# EAGLE design Connect (EAGLE 5.11)
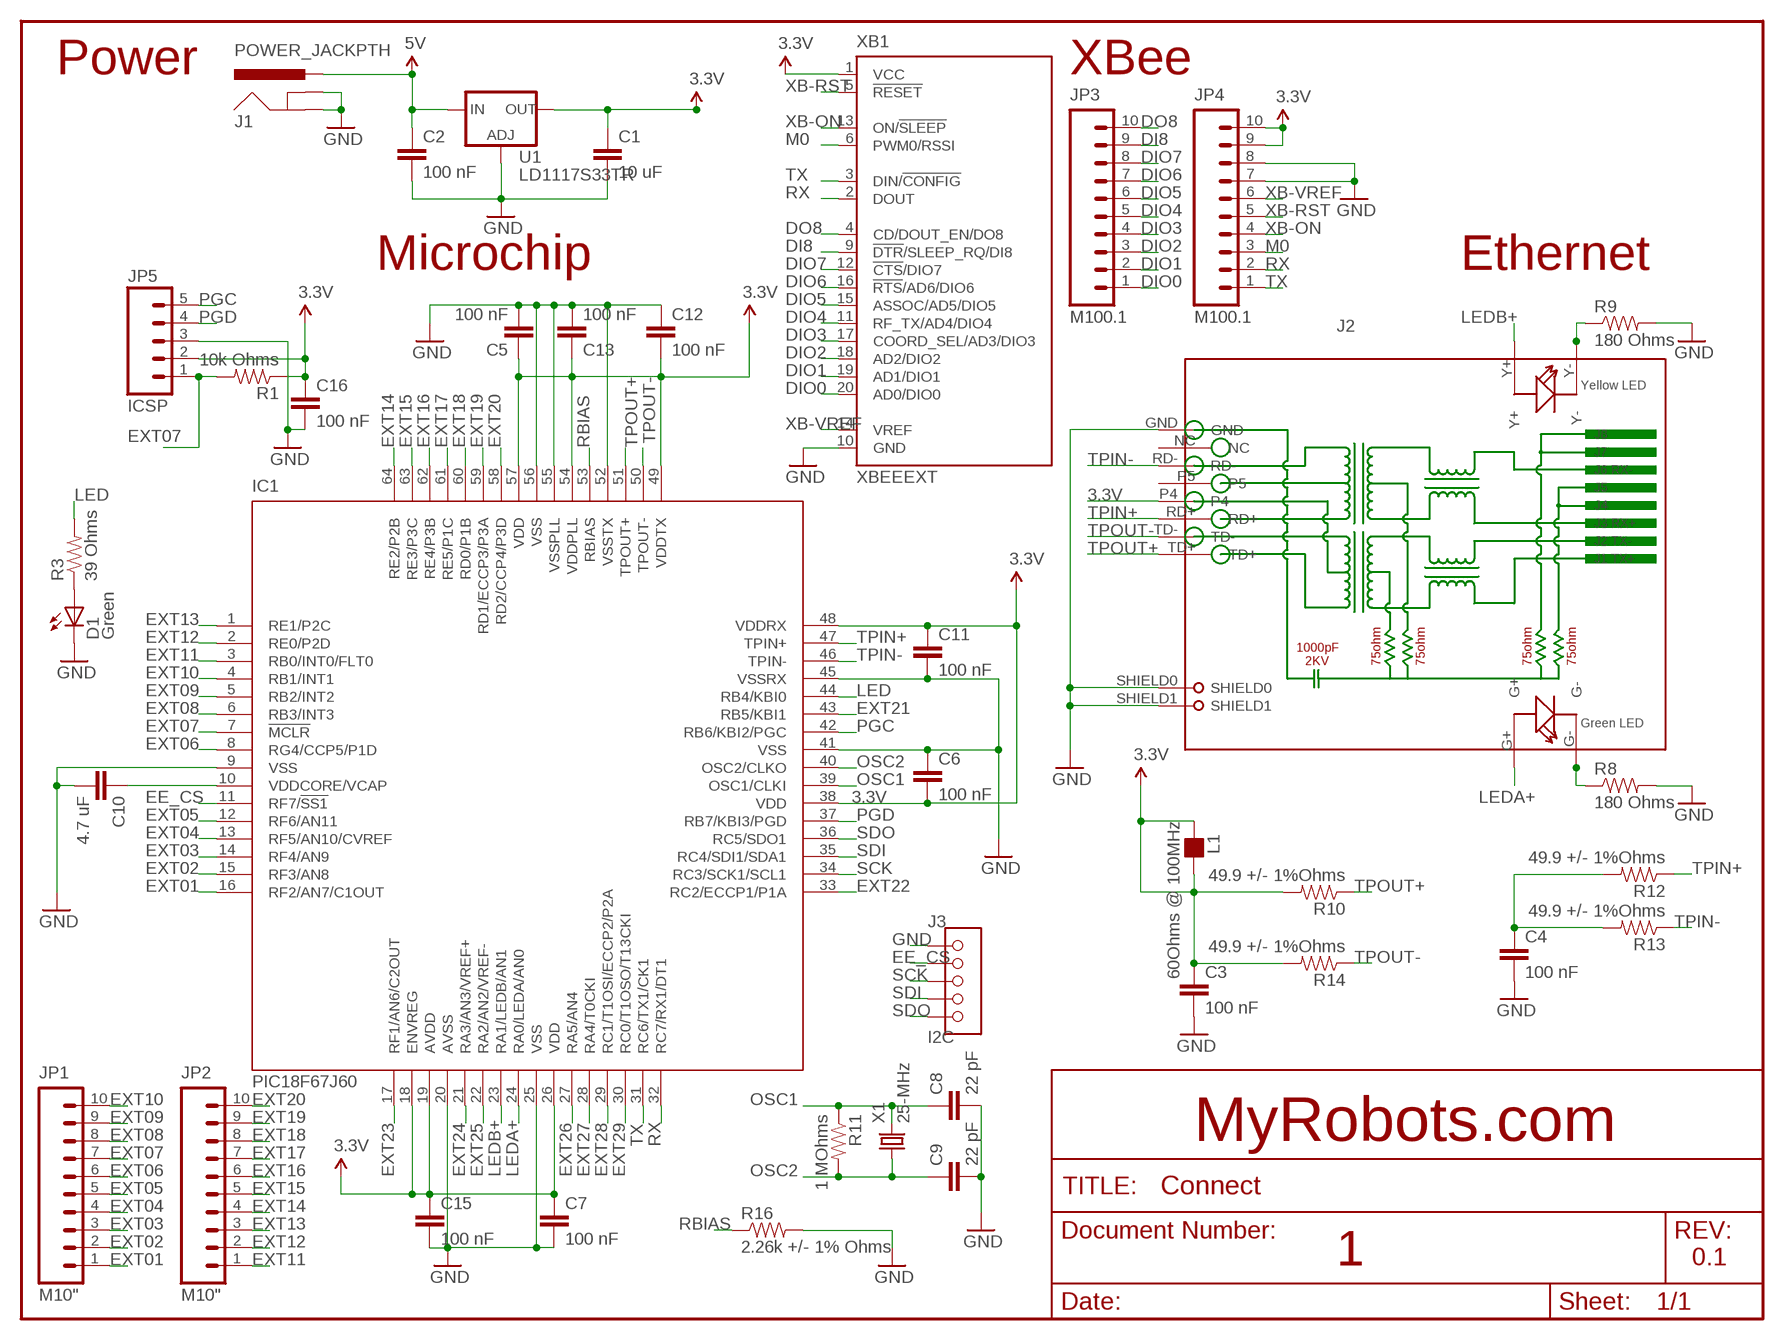
[diagram p0: schematic, sheet 1]

## Parts
C1  10 uF  CAP0603-CAP  [0603-CAP]
C2  100 nF  CAP0402-CAP  [0402-CAP]
C3  100 nF  CAP0402-CAP  [0402-CAP]
C4  100 nF  CAP0402-CAP  [0402-CAP]
C5  100 nF  CAP0402-CAP  [0402-CAP]
C6  100 nF  CAP0402-CAP  [0402-CAP]
C7  100 nF  CAP0402-CAP  [0402-CAP]
C8  22 pF  CAP0402-CAP  [0402-CAP]
C9  22 pF  CAP0402-CAP  [0402-CAP]
C10  4.7 uF  CAP0402-CAP  [0402-CAP]
C11  100 nF  CAP0402-CAP  [0402-CAP]
C12  100 nF  CAP0402-CAP  [0402-CAP]
C13  100 nF  CAP0402-CAP  [0402-CAP]
C15  100 nF  CAP0402-CAP  [0402-CAP]
C16  100 nF  CAP0402-CAP  [0402-CAP]
D1  Green  LEDCHIP-LED0805  [CHIP-LED0805]
IC1  PIC18F67J60  [TQFP64-10X10]
J1  POWER_JACKPTH  [POWER_JACK_PTH]
J2  RJ45-HR911105A-HR911105A  [RJ45]
J3  I2C  HEADER-5P-SMD2.0  [5P-2.0-SMD]
JP1  M10"  [1X10]
JP2  M10"  [1X10]
JP3  M100.1  [1X10]
JP4  M100.1  [1X10]
JP5  ICSP  M05PTH  [1X05]
L1  60Ohms @ 100MHz  FB_0402  [L0402]
R1  10k Ohms  RESISTOR0402-RES  [0402-RES]
R3  39 Ohms  RESISTOR0402-RES  [0402-RES]
R8  180 Ohms  RESISTOR0402-RES  [0402-RES]
R9  180 Ohms  RESISTOR0402-RES  [0402-RES]
R10  49.9 +/- 1%Ohms  RESISTOR0402-RES  [0402-RES]
R11  1 MOhms  RESISTOR0402-RES  [0402-RES]
R12  49.9 +/- 1%Ohms  RESISTOR0402-RES  [0402-RES]
R13  49.9 +/- 1%Ohms  RESISTOR0402-RES  [0402-RES]
R14  49.9 +/- 1%Ohms  RESISTOR0402-RES  [0402-RES]
R16  2.26k +/- 1% Ohms  RESISTOR0402-RES  [0402-RES]
U1  LD1117S33TR  V_REG_317SMD  [SOT223]
X1  25-MHz  CRYSTALCTS406  [CTS406]
XB1  XBEEEXT  [XBEE_PLUG]

## Nets
3.3V: C1.1 C3.1 C5.1 C6.2 C7.1 C11.1 C12.2 C13.1 C15.1 C16.1 IC1.18(ENVREG) IC1.19(AVDD) IC1.26(VDD) IC1.38(VDD) IC1.48(VDDRX) IC1.49(VDDTX) IC1.54(VDDPLL) IC1.57(VDD) J2.P4 JP4.9 JP4.10 JP5.2 L1.1 L1.2 R1.1 R10.2 R14.2 U1.2(OUT) XB1.1(VCC)
5V: C2.1 J1.PWR U1.3(IN)
DI8: JP3.9 XB1.9(!DTR!/SLEEP_RQ/DI8)
DIO0: JP3.1 XB1.20(AD0/DIO0)
DIO1: JP3.2 XB1.19(AD1/DIO1)
DIO2: JP3.3 XB1.18(AD2/DIO2)
DIO3: JP3.4 XB1.17(COORD_SEL/AD3/DIO3)
DIO4: JP3.5 XB1.11(RF_TX/AD4/DIO4)
DIO5: JP3.6 XB1.15(ASSOC/AD5/DIO5)
DIO6: JP3.7 XB1.16(!RTS!/AD6/DIO6)
DIO7: JP3.8 XB1.12(!CTS!/DIO7)
DO8: JP3.10 XB1.4(CD/DOUT_EN/DO8)
EE_CS: IC1.11(RF7/!SS1) J3.2
EXT01: IC1.16(RF2/AN7/C1OUT) JP1.1
EXT02: IC1.15(RF3/AN8) JP1.2
EXT03: IC1.14(RF4/AN9) JP1.3
EXT04: IC1.13(RF5/AN10/CVREF) JP1.4
EXT05: IC1.12(RF6/AN11) JP1.5
EXT06: IC1.8(RG4/CCP5/P1D) JP1.6
EXT07: IC1.7(!MCLR) JP1.7 JP5.1 R1.2
EXT08: IC1.6(RB3/INT3) JP1.8
EXT09: IC1.5(RB2/INT2) JP1.9
EXT10: IC1.4(RB1/INT1) JP1.10
EXT11: IC1.3(RB0/INT0/FLT0) JP2.1
EXT12: IC1.2(RE0/P2D) JP2.2
EXT13: IC1.1(RE1/P2C) JP2.3
EXT14: IC1.64(RE2/P2B) JP2.4
EXT15: IC1.63(RE3/P3C) JP2.5
EXT16: IC1.62(RE4/P3B) JP2.6
EXT17: IC1.61(RE5/P1C) JP2.7
EXT18: IC1.60(RD0/P1B) JP2.8
EXT19: IC1.59(RD1/ECCP3/P3A) JP2.9
EXT20: IC1.58(RD2/CCP4/P3D) JP2.10
EXT21: IC1.43(RB5/KBI1)
EXT22: IC1.33(RC2/ECCP1/P1A)
EXT23: IC1.17(RF1/AN6/C2OUT)
EXT24: IC1.21(RA3/AN3/VREF+)
EXT25: IC1.22(RA2/AN2/VREF-)
EXT26: IC1.27(RA5/AN4)
EXT27: IC1.28(RA4/T0CKI)
EXT28: IC1.29(RC1/T1OSI/ECCP2/P2A)
EXT29: IC1.30(RC0/T1OSO/T13CKI)
GND: C1.2 C2.2 C3.2 C4.2 C5.2 C6.1 C7.2 C8.2 C9.2 C10.2 C11.2 C12.1 C13.2 C15.2 C16.2 D1.C IC1.9(VSS) IC1.20(AVSS) IC1.25(VSS) IC1.41(VSS) IC1.45(VSSRX) IC1.52(VSSTX) IC1.55(VSSPLL) IC1.56(VSS) J1.GND J1.GNDBREAK J2.GND J2.SHIELD0 J2.SHIELD1 J3.1 JP4.7 JP4.8 JP5.3 R8.2 R9.2 R16.2 U1.1(ADJ) XB1.10(GND)
LED: IC1.44(RB4/KBI0) R3.2
LEDA+: IC1.24(RA0/LEDA/AN0) J2.G+
LEDB+: IC1.23(RA1/LEDB/AN1) J2.Y+
M0: JP4.3 XB1.6(PWM0/RSSI)
N$2: D1.A R3.1
N$3: J2.G- R8.1
N$4: J2.Y- R9.1
N$32: C4.1 R12.2 R13.2
N$59: C10.1 IC1.10(VDDCORE/VCAP)
OSC1: C8.1 IC1.39(OSC1/CLKI) R11.1 X1.3
OSC2: C9.1 IC1.40(OSC2/CLKO) R11.2 X1.1
PGC: IC1.42(RB6/KBI2/PGC) JP5.5
PGD: IC1.37(RB7/KBI3/PGD) JP5.4
RBIAS: IC1.53(RBIAS) R16.1
RX: IC1.32(RC7/RX1/DT1) JP4.2 XB1.2(DOUT)
SCK: IC1.34(RC3/SCK1/SCL1) J3.3
SDI: IC1.35(RC4/SDI1/SDA1) J3.4
SDO: IC1.36(RC5/SDO1) J3.5
TPIN+: IC1.47(TPIN+) J2.RD+ R12.1
TPIN-: IC1.46(TPIN-) J2.RD- R13.1
TPOUT+: IC1.51(TPOUT+) J2.TD+ R10.1
TPOUT-: IC1.50(TPOUT-) J2.TD- R14.1
TX: IC1.31(RC6/TX1/CK1) JP4.1 XB1.3(DIN/!CONFIG)
XB-ON: JP4.4 XB1.13(ON/!SLEEP)
XB-RST: JP4.5 XB1.5(!RESET)
XB-VREF: JP4.6 XB1.14(VREF)
Unconnected: J2.NC J2.P5

## Notes on the sheet
- Power | XBee
- Microchip | Ethernet
- MyRobots.com
- 1 | 0.1

## Library data of the parts
C1-C13 C15 C16 = SparkFun:CAP: Capacitor Standard 0603 ceramic capacitor, and 0.1" leaded capacitor.
D1 = led:LED: LED OSRAM: - CHIPLED LG R971, LG N971, LY N971, LG Q971, LY Q971, LO R971, LY R971 LH N974, LH R974 LS Q976, LO Q976, LY Q976 LO Q996 - Hyper CHIPLED LW Q18S LB Q993, LB Q99A, LB R99A - SideLED LS A670, LO A670, LY A670, LG A670, LP A670 LB A673, LV A673, LT A673, LW A673 LH A674 LY A675 LS A676, LA A676, LO A676, LY A676, LW A676 LS A679, LY A679, LG A679 - Hyper Micro SIDELED® LS Y876, LA Y876, LO Y876, LY Y876 LT Y87S - SmartLED LW L88C, LW L88S LB L89C, LB L89S, LG L890 LS L89K, LO L89K, LY L89K LS L896, LA L896, LO L896, LY L896 - TOPLED LS T670, LO T670, LY T670, LG T670, LP T670 LSG T670, LSP T670, LSY T670, LOP T670, LYG T670 LG T671, LOG T671, LSG T671 LB T673, LV T673, LT T673, LW T673 LH T674 LS T676, LA T676, LO T676, LY T676, LB T676, LH T676, LSB T676, LW T676 LB T67C, LV T67C, LT T67C, LS T67K, LO T67K, LY T67K, LW E67C LS E67B, LA E67B, LO E67B, LY E67B, LB E67C, LV E67C, LT E67C LW T67C LS T679, LY T679, LG T679 LS T770, LO T770, LY T770, LG T770, LP T770 LB T773, LV T773, LT T773, LW T773 LH T774 LS E675, LA E675, LY E675, LS T675 LS T776, LA T776, LO T776, LY T776, LB T776 LHGB T686 LT T68C, LB T68C - Hyper Mini TOPLED® LB M676 - Mini TOPLED Santana® LG M470 LS M47K, LO M47K, LY M47K Source: http://www.osram.convergy.de LUXEON: - LUMILED® LXK2-PW12-R00, LXK2-PW12-S00, LXK2-PW14-U00, LXK2-PW14-V00 LXK2-PM12-R00, LXK2-PM12-S00, LXK2-PM14-U00 LXK2-PE12-Q00, LXK2-PE12-R00, LXK2-PE12-S00, LXK2-PE14-T00, LXK2-PE14-U00 LXK2-PB12-K00, LXK2-PB12-L00, LXK2-PB12-M00, LXK2-PB14-N00, LXK2-PB14-P00, LXK2-PB14-Q00 LXK2-PR12-L00, LXK2-PR12-M00, LXK2-PR14-Q00, LXK2-PR14-R00 LXK2-PD12-Q00, LXK2-PD12-R00, LXK2-PD12-S00 LXK2-PH12-R00, LXK2-PH12-S00 LXK2-PL12-P00, LXK2-PL12-Q00, LXK2-PL12-R00 Source: www.luxeon.com KINGBRIGHT: KA-3528ASYC Source: www.kingbright.com
IC1 = microchip:PIC18F6*J6: PIC18F97J60 Family 64/80/100-Pin High-Performance, 1-Mbit Flash Microcontrollers with Ethernet Source: http://ww1.microchip.com/downloads/en/DeviceDoc/39762d.pdf; MPN: PIC18F67J60-I/PT; OC_FARNELL: 1332285; OC_NEWARK: 56K7302
J1 = SparkFun:POWER_JACK: Power Jack This is the standard 5.5mm barrel jack for power. The PTH is the most common, proven, reliable, footprint. All others are experimental. The Slot footprint only works if the mill layer is transmitted to the PCB fab house so be warned. Spark Fun Electronics SKU : PRT-00119. Mating wall wart : TOL-00298 (and others)
J2 = Connector2:RJ45-HR911105A
J3 = Connector2:HEADER-5P
JP1 JP2 = SparkFun:M10: Header 10 Standard 10-pin 0.1" header. Use with straight break away headers (SKU : PRT-00116), right angle break away headers (PRT-00553), swiss pins (PRT-00743), machine pins (PRT-00117), and female headers (PRT-00115).
JP3 JP4 = Connector:M10: Header 10 Standard 10-pin 0.1" header. Use with straight break away headers (SKU : PRT-00116), right angle break away headers (PRT-00553), swiss pins (PRT-00743), machine pins (PRT-00117), and female headers (PRT-00115).
JP5 = SparkFun:M05: Header 5 Standard 5-pin 0.1" header. Use with straight break away headers (SKU : PRT-00116), right angle break away headers (PRT-00553), swiss pins (PRT-00743), machine pins (PRT-00117), and female headers (PRT-00115). Molex polarized connector foot print use with SKU : PRT-08230 with associated crimp pins and housings.
L1 = rc-master:FB_: FERRITE BEAD
R1 R3 R8-R14 R16 = SparkFun:RESISTOR: Resistor Basic schematic elements and footprints for 0603, 1206, and PTH resistors.
U1 = SparkFun:V_REG_317: Voltage Regulator Standard LM317 adjustable voltage regulator. AOI (Adjust Output Input). Google 'LM317 Calculator' for easy to use app to get the two resistor values needed. 240/720 for 5V output. 240/390 for 3.3V output. Spark Fun Electronics SKU : COM-00527
X1 = crystal:CRYSTAL: CRYSTAL; OC_FARNELL: unknown; OC_NEWARK: unknown
XB1 = EXT_moudle:XBEE: XBee (TM) /XBee-PRO(TM) OEM RF Modules Source: MaxStream, Inc. xbee_productmanual.pdf

## Board
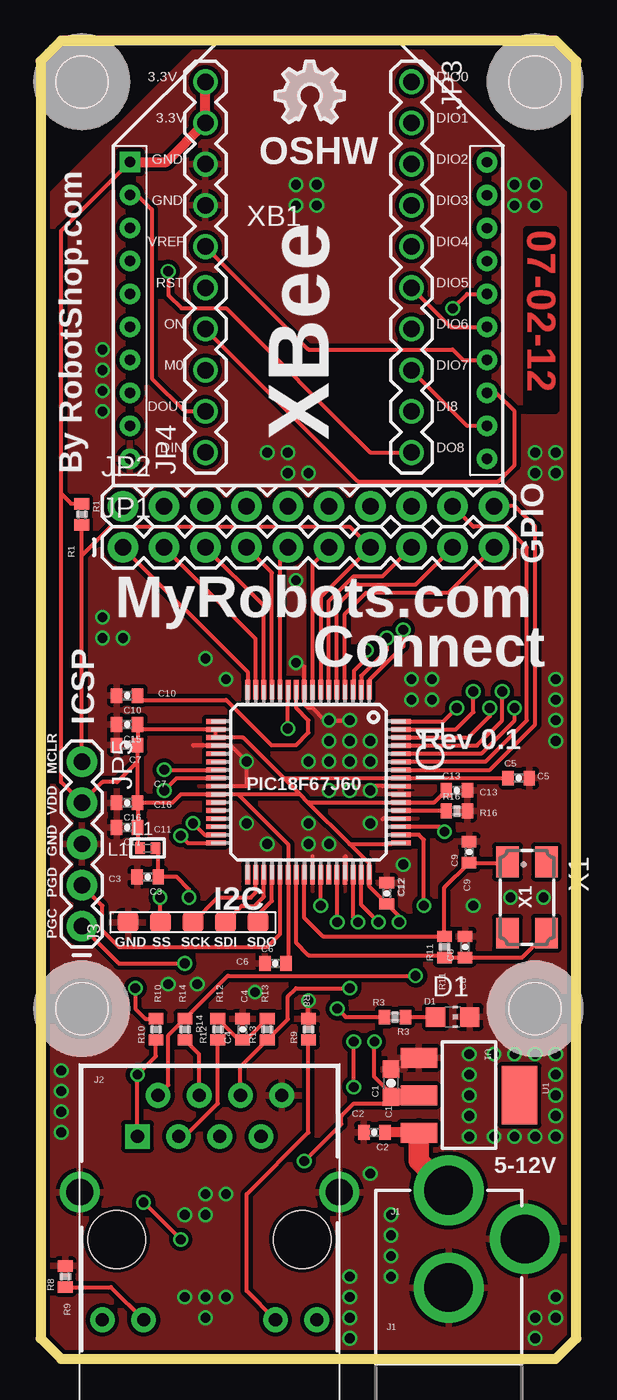
[diagram p1: board, top side]
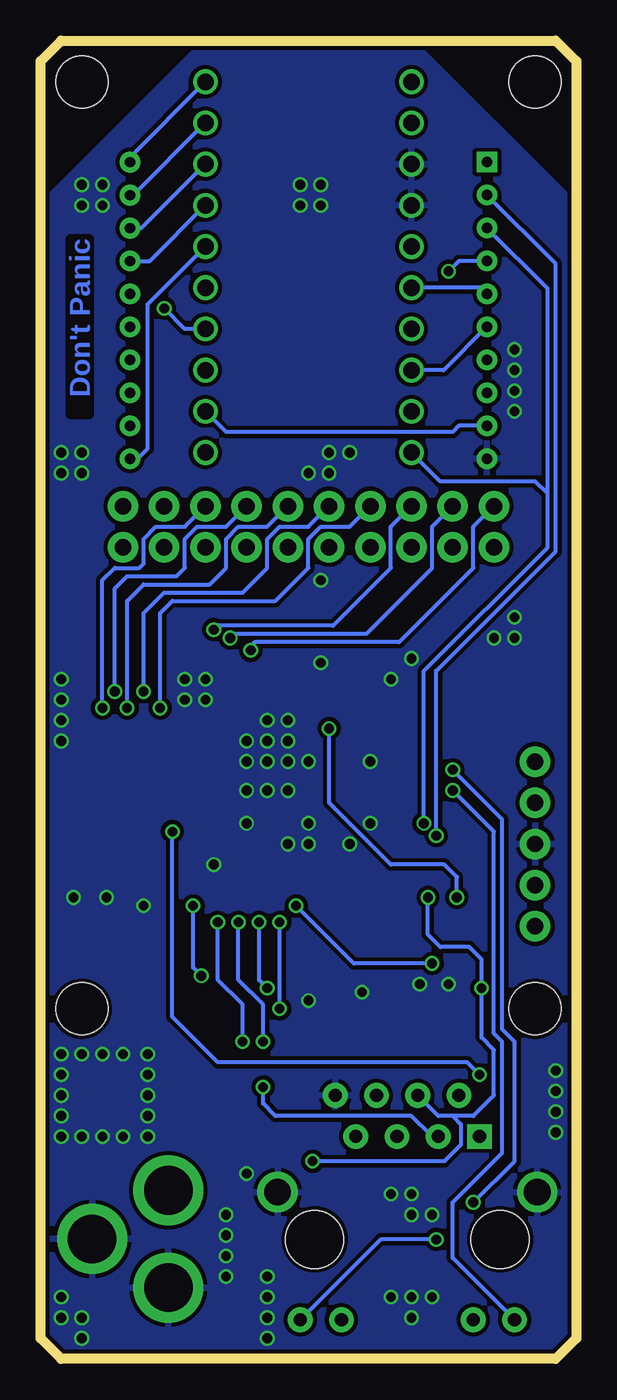
[diagram p2: board, bottom side, seen from below]

Size 33.02 x 81.28 mm. Coordinates in mm from the lower left corner, seen from the top.
Outline: 0,80.01 0,1.27 1.27,0 31.75,0 33.02,1.27 33.02,80.01 31.75,81.28 1.27,81.28 0,80.01
Copper layers (1*16): Top 0.035mm / dielectric 1.5mm / Bottom 0.035mm
Design rules "Fusion_eagle_rule_v1.1 *": minimum track width 6mil, minimum drill 12mil, track to track 6mil, track to pad 6mil, pad to pad 6mil, via to via 6mil, smd to smd 0mil, copper to edge 10mil, drill to drill 10mil, minimum pad ring 10mil, minimum via ring 6mil, stop-mask expansion 2mil, vias tented up to drill 100mil, thermal gap 10mil
Holes 3.2 mm at 2.54,21.59 30.48,21.59 30.48,78.74 2.54,78.74

### Footprints (pad centres in the part's own frame; a part is rotated, then mirrored left to right if it is on the bottom)
0603-CAP = smd 1.1 x 1: 1 -0.85,0; 2 0.85,0
0402-CAP = smd 0.7 x 0.9: 1 -0.65,0; 2 0.65,0
CHIP-LED0805 = smd 1.2 x 1.2: A 0,-1.05; C 0,1.05
TQFP64-10X10 = smd 1.2 x 0.3: 1 -5.7,3.75; 2 -5.7,3.25; 3 -5.7,2.75; 4 -5.7,2.25; 5 -5.7,1.75; 6 -5.7,1.25; 7 -5.7,0.75; 8 -5.7,0.25; 9 -5.7,-0.25; 10 -5.7,-0.75; 11 -5.7,-1.25; 12 -5.7,-1.75; 13 -5.7,-2.25; 14 -5.7,-2.75; 15 -5.7,-3.25; 16 -5.7,-3.75; 33 5.7,-3.75; 34 5.7,-3.25; 35 5.7,-2.75; 36 5.7,-2.25; 37 5.7,-1.75; 38 5.7,-1.25; 39 5.7,-0.75; 40 5.7,-0.25; 41 5.7,0.25; 42 5.7,0.75; 43 5.7,1.25; 44 5.7,1.75; 45 5.7,2.25; 46 5.7,2.75; 47 5.7,3.25; 48 5.7,3.75 | smd 0.3 x 1.2: 17 -3.75,-5.7; 18 -3.25,-5.7; 19 -2.75,-5.7; 20 -2.25,-5.7; 21 -1.75,-5.7; 22 -1.25,-5.7; 23 -0.75,-5.7; 24 -0.25,-5.7; 25 0.25,-5.7; 26 0.75,-5.7; 27 1.25,-5.7; 28 1.75,-5.7; 29 2.25,-5.7; 30 2.75,-5.7; 31 3.25,-5.7; 32 3.75,-5.7; 49 3.75,5.7; 50 3.25,5.7; 51 2.75,5.7; 52 2.25,5.7; 53 1.75,5.7; 54 1.25,5.7; 55 0.75,5.7; 56 0.25,5.7; 57 -0.25,5.7; 58 -0.75,5.7; 59 -1.25,5.7; 60 -1.75,5.7; 61 -2.25,5.7; 62 -2.75,5.7; 63 -3.25,5.7; 64 -3.75,5.7
POWER_JACK_PTH = drill 2.997 pad 4.318 round: GND 0,7.7; GNDBREAK 4.7,10.7; PWR 0,13.7
RJ45 = drill 0.813 pad 1.524 round: G+ 4.953,-6.604; G- 4.953,-4.064; GND -8.89,4.445; NC -6.35,3.175; P4 -8.89,-0.635; P5 -6.35,0.635; RD+ -6.35,-1.905; RD- -8.89,1.905; TD- -8.89,-3.175; Y+ 4.953,6.604; Y- 4.953,4.064 | drill 1.651 pad 2.159 round: SHIELD0 -2.921,8.001; SHIELD1 -2.921,-8.001 | drill 0.813 pad 1.524 square: TD+ -6.35,-4.445 | hole 3.556: 0,-5.715; 0,5.715
5P-2.0-SMD = smd 1.27 x 1.27: 1 0,4; 2 0,2; 3 0,0; 4 0,-2; 5 0,-4
1X10 = drill 1.016 pad 1.88 round: 1 0,0; 2 2.54,0; 3 5.08,0; 4 7.62,0; 5 10.16,0; 6 12.7,0; 7 15.24,0; 8 17.78,0; 9 20.32,0; 10 22.86,0
1X10' = drill 1.016 round: 1 0,0; 2 2.54,0; 3 5.08,0; 4 7.62,0; 5 10.16,0; 6 12.7,0; 7 15.24,0; 8 17.78,0; 9 20.32,0; 10 22.86,0
1X05 = drill 1.016 pad 1.88 round: 1 0,0; 2 2.54,0; 3 5.08,0; 4 7.62,0; 5 10.16,0
L0402 = smd 0.6 x 0.7: 1 -0.476,0; 2 0.476,0
0402-RES = smd 0.7 x 0.9: 1 -0.65,0; 2 0.65,0
SOT223 = smd 1.219 x 2.235: 1 -2.311,-3.099; 2 0,-3.099; 3 2.311,-3.099 | smd 3.6 x 2.2: 4 0,3.099
CTS406 = smd 1.9 x 1.4: 1 -2.2,-1.2; 2 2.2,-1.2; 3 2.2,1.2; 4 -2.2,1.2
XBEE_PLUG = drill 0.635 pad 1.27 square: 1 -11,-7.492 | drill 0.635 pad 1.27 round: 2 -11,-9.524; 3 -11,-11.556; 4 -11,-13.588; 5 -11,-15.62; 6 -11,-17.652; 7 -11,-19.684; 8 -11,-21.716; 9 -11,-23.748; 10 -11,-25.78; 11 10.996,-25.788; 12 10.996,-23.756; 13 10.996,-21.724; 14 10.996,-19.692; 15 10.996,-17.66; 16 10.996,-15.628; 17 10.996,-13.596; 18 10.996,-11.564; 19 10.996,-9.532; 20 10.996,-7.5

### Placement (x,y rotation side)
C1  21.59,17.02 90 top
C2  20.57,13.97 180 top
C3  6.6,29.72 180 top
C4  12.45,20.32 90 top
C5  29.46,35.81 0 top
C6  14.48,24.38 0 top
C7  5.33,37.85 180 top
C8  26.16,25.4 90 top
C9  26.42,31.24 90 top
C10  5.33,40.89 180 top
C11  5.33,32.77 180 top
C12  21.34,28.7 270 top
C13  25.65,35.05 0 top
C15  5.33,39.12 180 top
C16  5.33,34.29 180 top
D1  25.4,21.08 270 top
IC1  16.51,35.56 270 top
J1  25.15,-3.3 0 top
J2  10.41,7.37 270 top
J3  9.4,26.92 90 top
JP1  5.08,50.04 0 top
JP2  5.08,52.58 0 top
JP3  M100.1  [1X10']  22.86,78.74 270 top
JP4  M100.1  [1X10']  10.16,55.88 90 top
JP5  2.54,36.83 270 top
L1  6.6,31.5 0 top
R1  2.54,52.07 270 top
R3  21.84,21.08 180 top
R8  1.52,5.08 90 top
R9  16.51,20.32 90 top
R10  7.11,20.32 90 top
R11  24.89,25.4 90 top
R12  10.92,20.32 90 top
R13  13.97,20.32 90 top
R14  8.89,20.32 270 top
R16  25.65,33.78 0 top
U1  26.42,16.26 270 top
X1  29.97,28.45 270 top
XB1  16.51,81.28 0 top

### Tracks (layer width: path | path; a pad name or v marks a point on that pad's centre or on a via)
3.3V  (via drill 0.6)
  Top 0.254: XB1.1 1.27,69.55 1.27,53.34 | C16.1 8.13,34.29 8.65,34.81 IC1.26 12.18,34.81 | L1.1 5.98,31.64 C11.1 C16.1 | v20.57,19.56 20.57,17.38 21.59,16.37 C1.1 21.59,16 21.84,15.75 19.3,15.75 18.54,14.99 18.54,14.48 v16.26,12.19 | 1.27,53.34 1.27,35.56 JP5.2 3.81,35.56 4.71,35.56 5.98,36.83 | 15.24,24.5 C6.2 15.26,24.52 IC1.38 15.26,31.73 12.18,34.81 | C16.1 5.98,36.83 | 5.98,36.83 C7.1 C15.1 6.29,38.81 IC1.18 IC1.19 12.49,38.31 14.99,35.81 | R1.1 1.89,52.72 1.27,53.34 | 14.99,35.81 IC1.57 C5.1 | 19.05,31.75 21.59,31.75 21.65,31.81 IC1.49 | 15.99,34.81 14.99,35.81 | 21.59,34.31 16.53,34.31 16.51,34.29 | 21.59,34.31 IC1.54 24.26,34.31 C13.1 | 15.99,34.81 12.18,34.81 | 16.51,34.29 15.99,34.81 | J2.P4 9.78,18.78 R14.2 | 5.84,22.24 v5.84,22.86 5.84,21.59 6.46,20.97 R10.2 | v9.14,28.45 9.14,28.96 8.38,29.72 C3.1 7.25,31.32 L1.2 | 21.59,34.31 21.61,34.29 | v22.1,26.92 22.1,27.29 C12.2 20.26,29.13 IC1.48 20.26,30.54 19.05,31.75 | 19.05,31.75 16.51,34.29
  Top 0.61: JP4.10 JP4.9 7.75,73.79 XB1.1 | U1.2 23.2,16.37
  Top 1.016: C1.1 23.32,16.17 U1.2
  Bottom 0.254: v20.57,19.56 20.57,21.84 22.1,23.37 v22.1,26.92 | v9.14,28.45 9.14,26.16 8.38,25.4 6.6,25.4 5.84,24.64 v5.84,22.86 5.84,19.81 5.08,19.05 5.08,16.26 6.35,14.99 7.62,14.99 | J2.P4 8.51,14.99 7.62,14.99 | 7.62,14.99 7.11,14.48 7.11,13.21 8.13,12.19 v16.26,12.19
5V
  Top 0.61: 23.29,13.97 C2.1
  Top 1.016: U1.3 23.29,13.97
  Top 1.27: J1.PWR 23.32,12.23 U1.3
DI8
  Bottom 0.254: XB1.9 7.24,57.53 7.62,57.15 21.59,57.15 JP3.9
DIO0
  Bottom 0.254: JP3.1 27.51,74.09 XB1.20
DIO1
  Bottom 0.254: JP3.2 27.31,71.75 XB1.19
DIO2
  Bottom 0.254: JP3.3 26.8,69.72 XB1.18
DIO3
  Bottom 0.254: JP3.4 26.3,67.68 XB1.17
DIO4
  Bottom 0.254: JP3.5 26.42,65.02 26.42,56.13 27.06,55.49 XB1.11
DIO5
  Top 0.254: XB1.15 25.28,63.62 JP3.6
DIO6  (via drill 0.6)
  Top 0.254: XB1.16 26.28,65.65 v25.4,64.77
  Bottom 0.254: v25.4,64.77 24.13,63.5 JP3.7
DIO7
  Top 0.254: JP3.8 26.3,57.52 XB1.12
DO8  (via drill 0.6)
  Top 0.254: JP3.10 20.32,55.88 11.43,64.77 8.69,64.77 7.87,65.58 v7.87,67.06
  Bottom 0.254: v7.87,67.06 7.24,67.69 XB1.4
EE_CS  (via drill 0.6)
  Top 0.254: v7.37,28.45 7.37,26.96 J3.2 | IC1.11 15.24,41.24 v15.24,38.86
  Bottom 0.254: v15.24,38.86 15.24,34.29 11.43,30.48 8.13,30.48 7.37,29.72 v7.37,28.45
EXT01
  Top 0.254: IC1.16 12.76,42.36 JP1.1
EXT02
  Top 0.254: IC1.15 13.26,44.4 JP1.2
EXT03
  Top 0.254: IC1.14 13.76,46.44 JP1.3
EXT04
  Top 0.254: IC1.13 14.26,48.48 JP1.4
EXT05
  Top 0.254: IC1.12 14.76,49.56 JP1.5
EXT06
  Top 0.254: IC1.8 16.76,49.02 JP1.6
EXT07
  Top 0.254: IC1.7 17.26,46.98 JP1.7 19.05,51.31 4.32,51.31 2.54,49.53 | 2.54,49.53 R1.2 | JP5.1 2.54,49.53
EXT08
  Top 0.254: JP1.8 21.08,48.26 19.3,48.26 17.76,46.72 IC1.6
EXT09
  Top 0.254: JP1.9 23.11,47.75 19.56,47.75 18.26,46.45 IC1.5
EXT10
  Top 0.254: IC1.4 18.76,45.94 20.07,47.24 25.15,47.24 JP1.10
EXT11  (via drill 0.6)
  Top 0.254: IC1.3 19.3,41.3 19.3,42.42 20.07,43.18 v20.07,43.69
  Bottom 0.254: JP2.1 6.35,51.31 6.35,48.77 10.92,44.2 19.81,44.2 20.07,43.94 v20.07,43.69
EXT12  (via drill 0.6)
  Top 0.254: IC1.2 19.76,42.11 21.34,43.69 v21.34,44.45
  Bottom 0.254: v21.34,44.45 21.08,44.7 12.95,44.7 8.89,48.77 8.89,51.31 JP2.2
EXT13  (via drill 0.6)
  Top 0.254: IC1.1 20.26,41.85 22.35,43.94 v22.35,44.96
  Bottom 0.254: JP2.3 11.43,51.31 11.43,48.77 14.99,45.21 22.1,45.21 v22.35,44.96
EXT14  (via drill 0.6)
  Top 0.254: v25.65,40.13 24.83,39.31 IC1.64
  Bottom 0.254: JP2.4 13.97,51.31 15.75,51.31 16.51,50.55 16.51,48.77 18.54,46.74 24.89,46.74 25.65,45.97 v25.65,40.13 25.65,40.39
EXT15  (via drill 0.6)
  Top 0.254: v26.67,41.15 26.67,39.88 25.6,38.81 IC1.63
  Bottom 0.254: JP2.5 16.51,51.31 18.29,51.31 19.05,50.55 19.05,48.77 20.57,47.24 25.4,47.24 26.67,45.97 v26.67,41.15
EXT16  (via drill 0.6)
  Top 0.254: v27.69,40.13 27.69,39.62 26.37,38.31 IC1.62
  Bottom 0.254: JP2.6 19.05,51.31 20.83,51.31 21.59,50.55 21.59,48.77 22.61,47.75 26.67,47.75 27.69,46.74 v27.69,40.13
EXT17  (via drill 0.6)
  Top 0.254: IC1.61 26.89,37.81 28.45,39.37 v28.45,41.15
  Bottom 0.254: JP2.7 21.59,51.31 23.37,51.31 24.13,50.55 24.13,48.77 24.64,48.26 27.69,48.26 28.45,47.5 v28.45,41.15
EXT18  (via drill 0.6)
  Top 0.254: IC1.60 22.24,37.34 27.18,37.34 29.21,39.37 v29.21,40.13
  Bottom 0.254: JP2.8 24.13,51.31 25.91,51.31 26.67,50.55 26.67,49.02 26.92,48.77 28.45,48.77 29.21,48.01 v29.21,40.13
EXT19
  Top 0.254: IC1.59 22.23,36.83 27.43,36.83 29.97,39.37 29.97,50.04 28.7,51.31 26.67,51.31 JP2.9
EXT20
  Top 0.254: IC1.58 22.22,36.32 27.69,36.32 30.48,39.12 30.48,51.31 29.21,52.58 JP2.10
GND  (via drill 0.6)
  Top 0.254: IC1.45 18.76,30.95 18.8,30.99 18.8,29.46 | 9.4,37.85 9.43,37.81 IC1.20 11.72,37.81 v12.7,36.83 12.7,35.31 IC1.25 | IC1.41 16.76,29.46 | 16.76,30.48 16.76,30.99 | 16.76,30.48 IC1.41 | IC1.41 16.76,30.48 | IC1.52 21.12,33.31 21.08,33.27 | v19.05,39.37 17.53,39.37 16.76,40.13 16.51,40.13 16.26,40.39 IC1.9 16.26,42.67 16,42.93 | IC1.56 21.09,35.31 | 21.09,35.31 21.08,35.31 | 21.09,35.31 20.58,35.31 v20.32,35.05 | R9.2 v16.51,22.1
  other vias: 19.05,38.1 19.05,36.83 17.78,31.75 20.32,33.02 16.51,31.75 16.51,33.02 12.7,33.02 13.97,31.75 17.78,35.05 17.78,36.83 17.78,38.1 17.78,39.37 16.51,36.83 20.32,38.1 20.32,36.83 15.75,48.01 22.86,41.91 24.13,40.64 31.75,39.37 10.16,10.16 11.43,10.16 29.21,13.72 30.48,13.72 26.42,13.72 29.21,18.8 26.42,18.8 26.42,17.53 30.48,18.8 26.42,16.26 26.42,14.99 31.75,2.54 8.89,3.81 10.16,3.81 11.43,3.81 10.16,2.54 10.16,8.89 8.89,8.89 1.27,17.78 1.27,15.24 1.27,16.51 1.27,13.97 31.75,38.1 31.75,40.64 31.75,41.91 24.13,41.91 22.86,40.64 31.75,3.81 30.48,2.54 30.48,1.27 10.16,43.18 11.43,41.91 13.97,55.88 15.24,55.88 15.24,54.61 16.51,54.61 3.81,62.23 3.81,60.96 3.81,59.69 3.81,58.42 30.48,55.88 30.48,54.61 31.75,54.61 31.75,55.88 15.75,72.39 17.02,72.39 15.75,71.12 17.02,71.12 31.75,13.72 31.75,14.99 31.75,16.26 31.75,17.53 31.75,18.8 27.94,18.8 27.94,13.72 26.67,27.94 28.96,28.45 13.21,22.61 7.87,23.11 30.99,28.45 3.81,44.45 5.08,44.45 3.81,45.72 19.05,1.27 19.05,2.54 19.05,3.81 19.05,5.08 9.65,23.11 19.05,35.05 15.75,42.93 22.35,30.48 20.32,11.43 21.59,8.89 21.59,7.62 21.59,6.35 21.59,5.08 30.48,71.12 30.48,72.39 29.21,71.12 29.21,72.39
  pour Top (isolate 0.254): 0,0 0,71.12 10.16,81.28 22.86,81.28 33.02,71.12 33.02,0
  pour Bottom (isolate 0.254): 0,0 0,71.12 10.16,81.28 22.86,81.28 33.02,71.12 33.02,0
LED  (via drill 0.6)
  Top 0.254: IC1.44 18.29,29.83 v18.29,26.92 | v18.29,21.59 18.8,21.08 R3.2
  Bottom 0.254: v18.29,21.59 v18.29,26.92
LEDA+  (via drill 0.6)
  Top 0.254: IC1.24 8.38,35.81 v7.62,35.05
  Bottom 0.254: v7.62,35.05 5.08,32.51 5.08,20.07 4.57,19.56 4.57,12.7 7.62,9.65 7.62,6.22 J2.G+
LEDB+  (via drill 0.6)
  Top 0.254: v7.62,36.32 7.63,36.31 IC1.23 | v6.35,9.65 v8.64,7.37
  Bottom 0.254: v7.62,36.32 4.57,33.27 4.57,20.32 3.81,19.56 3.81,12.19 v6.35,9.65 | v8.64,7.37 12.06,7.37 J2.Y+
M0
  Bottom 0.254: JP4.3 8.18,60.96 XB1.6
N$2
  Top 0.254: R3.1 D1.A
N$3
  Top 0.254: R8.1 4.33,4.43 J2.G-
N$4
  Top 0.254: R9.1 16.51,13.97 12.7,10.16 12.7,4.19 J2.Y-
N$32
  Top 0.254: R12.2 12.22,19.67 C4.1 12.67,19.67 R13.2
N$59
  Top 0.254: IC1.10 15.76,40.12 16.51,39.37 16.51,38.61 15.75,37.85 14.22,37.85 11.43,40.64 6.24,40.64 C10.1
OSC1
  Top 0.254: C8.1 R11.1 24.75,24.89 16.51,24.89 15.76,25.64 IC1.39 | C8.1 26.27,24.75 | C8.1 29.67,24.75 X1.3
OSC2
  Top 0.254: IC1.40 16.26,27.18 17.38,26.05 R11.2 24.89,29.07 C9.1 28.72,30.59 X1.1
PGC  (via drill 0.6)
  Top 0.254: IC1.42 17.27,29.85 v17.27,27.94 | JP5.5 4.83,24.38 v8.89,24.38
  Bottom 0.254: v17.27,27.94 13.72,24.38 v8.89,24.38
PGD
  Top 0.254: IC1.37 14.76,26.19 13.97,25.4 4.83,25.4 3.81,26.42 3.81,27.94 JP5.4
RBIAS
  Top 0.254: IC1.53 24.98,33.81 R16.1
RX  (via drill 0.6)
  Top 0.254: IC1.32 9.08,31.81 v8.64,32.26 | JP4.2 8.89,58.42 6.86,60.45 6.86,70.87 5.97,71.76 XB1.2
  Bottom 0.254: v8.64,32.26 8.64,42.42 1.27,49.78 1.27,67.52 XB1.2
SCK
  Top 0.254: J3.3 10.92,28.45 12.95,28.45 13.26,28.75 IC1.34
SDI
  Top 0.254: J3.4 12.41,27.94 13.21,27.94 13.76,28.49 IC1.35
SDO
  Top 0.254: IC1.36 14.26,28.23 13.4,27.37 J3.5
TPIN+  (via drill 0.6)
  Top 0.254: v19.3,16.76 v19.3,19.56 | v20.83,26.92 19.76,27.99 IC1.47 | R12.1 10.92,15.75 8.89,13.72 J2.RD+
  Bottom 0.254: v19.3,19.56 19.3,21.84 20.83,23.37 v20.83,26.92 | v19.3,16.76 19.3,15.75 18.54,14.99 10.16,14.99 8.89,13.72 J2.RD+
TPIN-  (via drill 0.6)
  Top 0.254: v19.05,22.86 15.75,22.86 15.24,22.35 15.24,20.94 R13.1 12.32,18.02 J2.RD- | v19.56,26.92 19.26,27.22 IC1.46
  Bottom 0.254: v19.05,22.86 19.56,23.37 v19.56,26.92
TPOUT+  (via drill 0.6)
  Top 0.254: IC1.51 24.59,32.81 v24.89,32.51 | R10.1 7.11,18.67 v5.97,17.53 J2.TD+
  Bottom 0.254: v24.89,32.51 24.89,21.08 22.1,18.29 6.73,18.29 v5.97,17.53
TPOUT-  (via drill 0.6)
  Top 0.254: IC1.50 23.32,32.31 23.62,32 v23.62,27.94 | v23.11,23.62 11.54,23.62 R14.1 7.87,19.95 7.87,16.89 J2.TD-
  Bottom 0.254: v23.62,27.94 23.62,24.13 v23.11,23.62
TX  (via drill 0.6)
  Top 0.254: IC1.31 10.11,32.31 v9.4,33.02
  Bottom 0.254: v9.4,33.02 9.4,42.42 1.78,50.04 1.78,53.34 | 1.78,53.34 1.78,65.99 XB1.3 | JP4.1 8.38,54.1 2.54,54.1 1.78,53.34
XB-ON
  Top 0.254: XB1.13 28.07,59.56 29.21,58.42 29.21,55.12 28.19,54.1 19.56,54.1 JP4.4
XB-RST
  Bottom 0.254: JP4.5 5.89,66.04 XB1.5
XB-VREF
  Top 0.254: XB1.14 26.04,61.59 25.4,62.23 16.51,62.23 JP4.6

### Text on the board
Top: 07-02-12
Bottom: Don't Panic
tSilk: 3.3V | DIO0 | 3.3V | DIO1 | GND | OSHW | DIO2 | GND | DIO3 | VREF | DIO4 | RST | DIO5 | ON | DIO6 | M0 | DIO7 | DOUT | DI8 | XBee | DIN | DO8 | By RobotShop.com | R1 | GPIO | MyRobots.com | Connect | C10 | ICSP | Rev 0.1 | MCLR | C5 | C7 | PIC18F67J60 | C13 | VDD | C16 | R16 | C11 | GND | L1 | C3 | C12 | C9 | X1 | PGD | I2C | PGC | GND | SS | SCK | SDI | SDO | C6 | R11 | C8 | R10 | R14 | R12 | C4 | R13 | R8 | R3 | D1 | U1 | J2 | C2 | C1 | 5-12V | J1 | R9